# EAGLE schematic swigert (EAGLE 7.6.0)
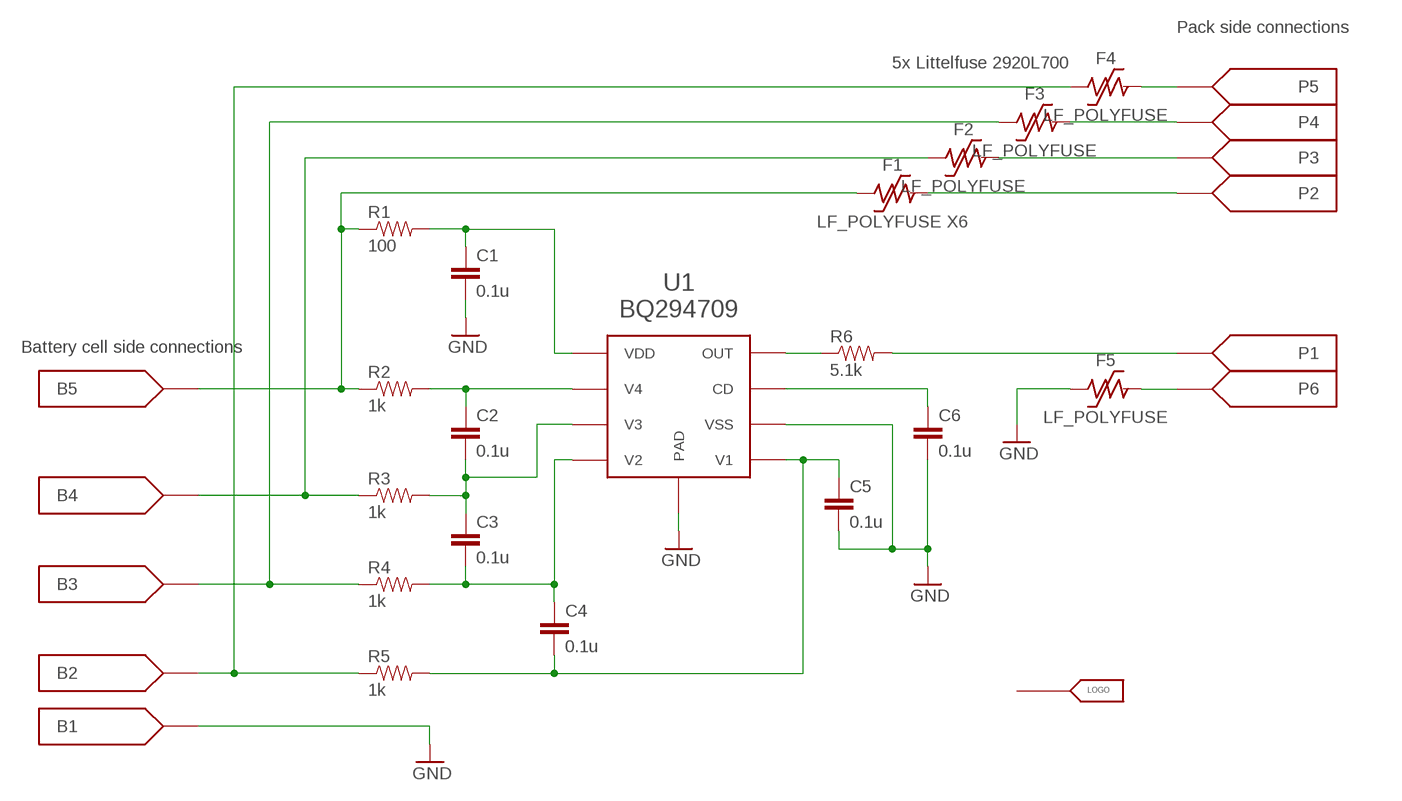
[diagram p0: schematic, sheet 1]

## Parts
B1  MOLEX_SRT  [MOLEX_SRT_14-20]
B2  MOLEX_SRT  [MOLEX_SRT_14-20]
B3  MOLEX_SRT  [MOLEX_SRT_14-20]
B4  MOLEX_SRT  [MOLEX_SRT_14-20]
B5  MOLEX_SRT  [MOLEX_SRT_14-20]
C1  0.1u  CAP1206  [1206]
C2  0.1u  CAP1206  [1206]
C3  0.1u  CAP1206  [1206]
C4  0.1u  CAP1206  [1206]
C5  0.1u  CAP1206  [1206]
C6  0.1u  CAP1206  [1206]
F1  LF_POLYFUSE X6  LF_POLYFUSE  [2920]
F2  LF_POLYFUSE  [2920]
F3  LF_POLYFUSE  [2920]
F4  LF_POLYFUSE  [2920]
F5  LF_POLYFUSE  [2920]
LOGO  SU_LOGO-DUMMY2  [SU_LOGO_SS]
P1  MOLEX_SRT  [MOLEX_SRT_14-20]
P2  MOLEX_SRT  [MOLEX_SRT_14-20]
P3  MOLEX_SRT  [MOLEX_SRT_14-20]
P4  MOLEX_SRT  [MOLEX_SRT_14-20]
P5  MOLEX_SRT  [MOLEX_SRT_14-20]
P6  MOLEX_SRT  [MOLEX_SRT_14-20]
R1  100  RESISTOR1206  [1206]
R2  1k  RESISTOR1206  [1206]
R3  1k  RESISTOR1206  [1206]
R4  1k  RESISTOR1206  [1206]
R5  1k  RESISTOR1206  [1206]
R6  5.1k  RESISTOR1206  [1206]
U1  BQ294709  BQ2947  [WSON8]

## Nets
GND: B1.P$1(P1) B1.P$2(P1) C1.2 C5.2 C6.2 F5.P$1 U1.P$6(VSS) U1.P$9(PAD) U1.P$9_1(PAD) U1.P$9_2(PAD)
N$1: C1.1 R1.2 U1.P$1(VDD)
N$2: C2.1 R2.2 U1.P$2(V4)
N$3: C2.2 C3.1 R3.2 U1.P$3(V3)
N$4: C3.2 C4.1 R4.2 U1.P$4(V2)
N$5: C4.2 C5.1 R5.2 U1.P$5(V1)
N$6: F4.P$2 P5.P$1(P1) P5.P$2(P1)
N$7: B2.P$1(P1) B2.P$2(P1) F4.P$1 R5.1
N$8: C6.1 U1.P$7(CD)
N$9: B3.P$1(P1) B3.P$2(P1) F3.P$1 R4.1
N$10: B4.P$1(P1) B4.P$2(P1) F2.P$1 R3.1
N$11: B5.P$1(P1) B5.P$2(P1) F1.P$1 R1.1 R2.1
N$12: R6.1 U1.P$8(OUT)
N$13: P1.P$1(P1) P1.P$2(P1) R6.2
N$14: F3.P$2 P4.P$1(P1) P4.P$2(P1)
N$15: F2.P$2 P3.P$1(P1) P3.P$2(P1)
N$16: F1.P$2 P2.P$1(P1) P2.P$2(P1)
N$17: F5.P$2 P6.P$1(P1) P6.P$2(P1)
Unconnected: LOGO.P$1

## Notes on the sheet
- Pack side connections
- 5x Littelfuse 2920L700
- Battery cell side connections

## Library data of the parts
B1-B5 P1-P6 = components:MOLEX_SRT
C1-C6 = SparkFun-Capacitors:CAP: Capacitor Standard 0603 ceramic capacitor, and 0.1" leaded capacitor.
F1-F5 = components:LF_POLYFUSE
LOGO = components:SU_LOGO-DUMMY2
R1-R6 = SparkFun-Resistors:RESISTOR: Resistor Basic schematic elements and footprints for 0603, 1206, and PTH resistors.
U1 = components:BQ2947